# Altium schematic sheet E18-MS1.SchDoc
size 420 x 297 mm; ApprovedBy: Алексеев; CheckedBy: Богданов; Author: Шумкин; SheetNumber: 1; SheetTotal: 1
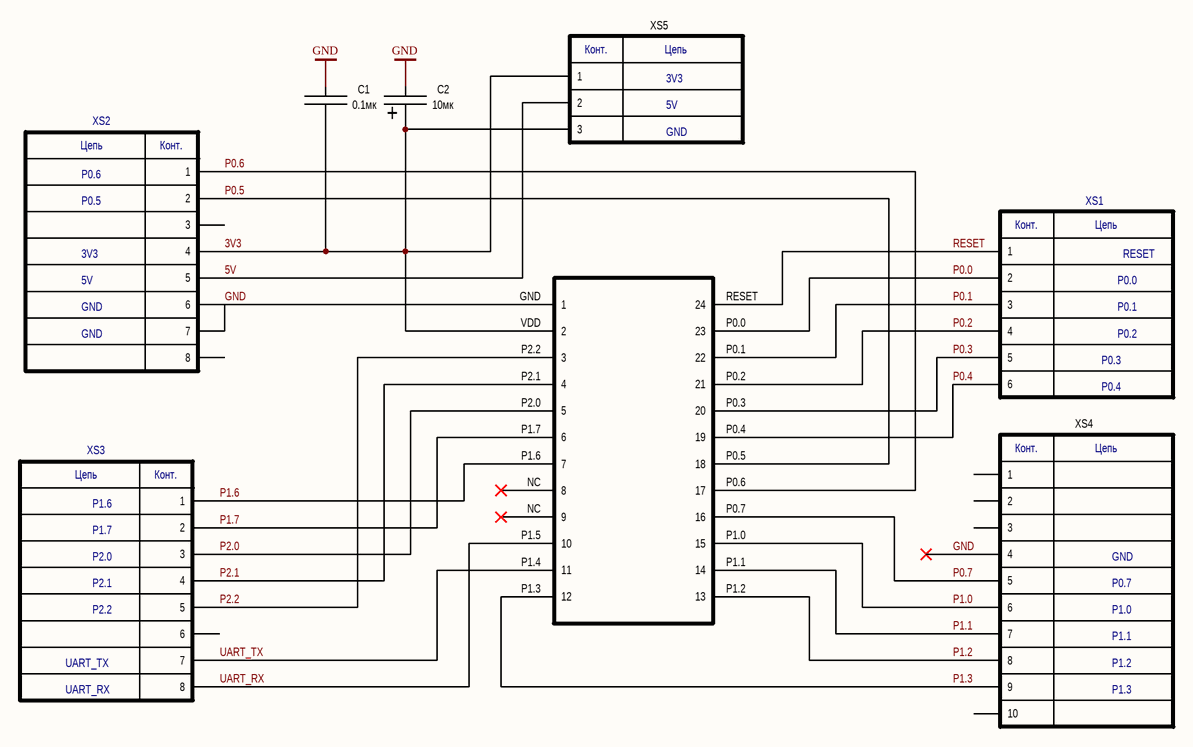
[diagram p0: E18-MS1.SchDoc]

## Parts
C1  value 0.1мк  [C0603]  (hidden comment: C)
C2  value 10мк  [Case A]  (hidden comment: C_el)
MCU  E18-MS1-PCB  [E18-MS1]  (value not drawn)
XS1  6pin  [PLS-6]  (value not drawn)
XS2  8pin  [PLS-8]  (value not drawn)
XS3  8pin  [PLS-8]  (value not drawn)
XS4  10pin  [PLS-10]  (value not drawn)
XS5  3pin  [PLS-3]  (value not drawn)

## Nets
GND: C1.2 C2.2 MCU.GND(1) XS2.6 XS2.7 XS4.4
3V3: C1.1 C2.1 MCU.VDD(2) XS2.4 XS5.1 XS5.3
5V: XS2.5 XS5.2
P0.0: MCU.P0.0(23) XS1.2
P0.1: MCU.P0.1(22) XS1.3
P0.2: MCU.P0.2(21) XS1.4
P0.3: MCU.P0.3(20) XS1.5
P0.4: MCU.P0.4(19) XS1.6
P0.5: MCU.P0.5(18) XS2.2
P0.6: MCU.P0.6(17) XS2.1
P0.7: MCU.P0.7(16) XS4.5
P1.0: MCU.P1.0(15) XS4.6
P1.1: MCU.P1.1(14) XS4.7
P1.2: MCU.P1.2(13) XS4.8
P1.3: MCU.P1.3(12) XS4.9
P1.6: MCU.P1.6(7) XS3.1
P1.7: MCU.P1.7(6) XS3.2
P2.0: MCU.P2.0(5) XS3.3
P2.1: MCU.P2.1(4) XS3.4
P2.2: MCU.P2.2(3) XS3.5
RESET: MCU.RESET(24) XS1.1
UART_RX: MCU.P1.5(10) XS3.8
UART_TX: MCU.P1.4(11) XS3.7

Not connected (* = marked no-connect by the designer): MCU NC(8)*; XS2 3 8; XS3 6; XS4 1 2 3 10

## Notes on the sheet
- 3V3
- GND
- 5V
- P0.6
- P0.5
- RESET
- P0.0
- P0.1
- P0.2
- P0.4
- P0.3
- P1.7
- P1.6
- P2.2
- P2.1
- P2.0
- P0.7
- P1.0
- UART_TX
- P1.1
- P1.2
- UART_RX
- P1.3
- Перв.примен.
- Справ. №
- Подп. и дата
- Инв.№ дубл.
- Взам. инв. №
- Изм.
- Лист
- № докум.
- Подп.
- Дата
- Лит.
- Масса
- Масштаб
- Пров.
- Т.контр
- Разраб.
- Листов
- Инв № подл.
- Н.контр.
- Утв.
- Копировал
- Формат А3
- (in symbol 3pin) Конт.; Цепь
- (in symbol 6pin) Конт.; Цепь
- (in symbol 8pin) Цепь; Конт.
- (in symbol 10pin) Конт.; Цепь
- (in symbol C_el) +

## Library data of the parts
C1 = C: Tolerance: %; Voltage: В; PartNumber: *; Dielectric: *; Case: *; Mount: *
C2 = C_el: Tolerance: %; Voltage: V; Dielectric: *; PartNumber: *; Case: *; Mount: *
XS1 = 6pin: Manufacturer: *; PartNumber: *
XS2 XS3 = 8pin: Manufacturer: *; PartNumber: *
XS4 = 10pin: Manufacturer: *; PartNumber: *
XS5 = 3pin: Manufacturer: *; PartNumber: *